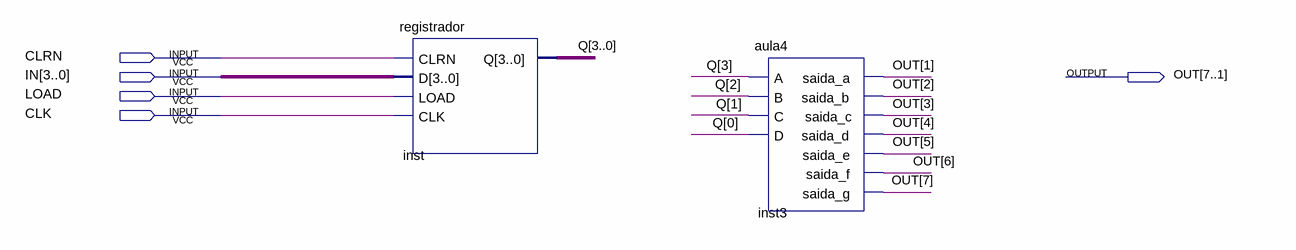
[diagram p0: schematic sheet]
// Quartus schematic cpu.bdf as structural Verilog: 2 symbols, 5 pins
module cpu (
  input  CLRN,
  input  [3:0] IN,
  input  LOAD,
  input  CLK,
  output [7:1] OUT
);

  wire [3:0] Q;

  registrador inst (.CLRN(CLRN), .D(IN), .LOAD(LOAD), .CLK(CLK), .Q(Q));
  aula4 inst3 (
    .A(Q[3]), .B(Q[2]), .C(Q[1]), .D(Q[0]), .saida_a(OUT[1]), .saida_b(OUT[2]), .saida_c(OUT[3]),
    .saida_d(OUT[4]), .saida_e(OUT[5]), .saida_f(OUT[6]), .saida_g(OUT[7]));
endmodule
